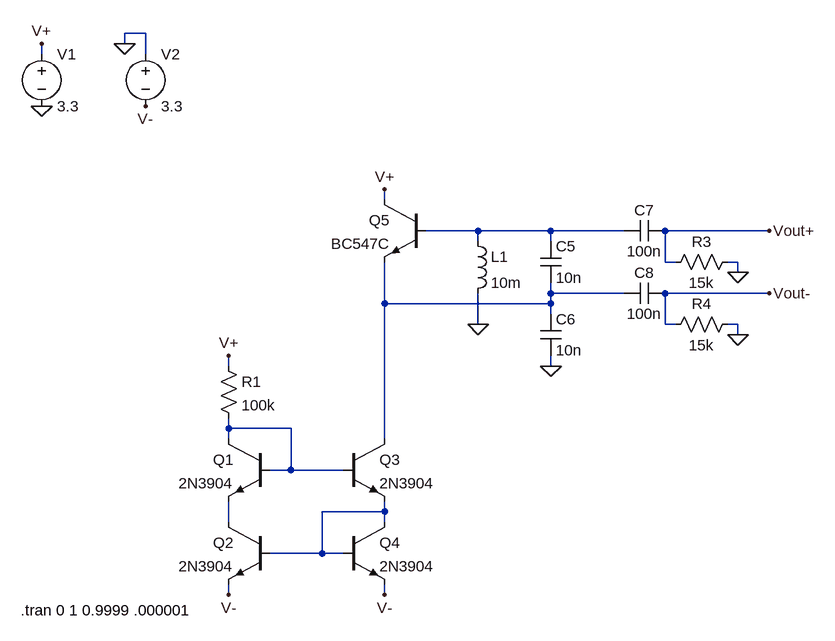
[diagram p0: schematic 06A-20.asc]
06A-20.asc, the LTspice schematic file:
Version 4.1
SHEET 1 1064 776
WIRE 16 -160 -16 -160
WIRE -16 -144 -16 -160
WIRE -144 -128 -144 -144
WIRE 16 -128 16 -160
WIRE 384 96 384 80
WIRE 528 144 448 144
WIRE 640 144 528 144
WIRE 752 144 640 144
WIRE 976 144 816 144
WIRE 528 160 528 144
WIRE 640 160 640 144
WIRE 816 192 816 144
WIRE 832 192 816 192
WIRE 928 192 912 192
WIRE 928 208 928 192
WIRE 640 240 640 224
WIRE 752 240 640 240
WIRE 976 240 816 240
WIRE 384 256 384 192
WIRE 640 256 640 240
WIRE 640 256 384 256
WIRE 640 272 640 256
WIRE 528 288 528 240
WIRE 816 288 816 240
WIRE 832 288 816 288
WIRE 928 288 912 288
WIRE 928 304 928 288
WIRE 144 352 144 336
WIRE 640 352 640 336
WIRE 144 448 144 432
WIRE 240 448 144 448
WIRE 144 464 144 448
WIRE 384 464 384 256
WIRE 240 512 240 448
WIRE 240 512 208 512
WIRE 320 512 240 512
WIRE 384 576 384 560
WIRE 384 576 288 576
WIRE 144 592 144 560
WIRE 384 592 384 576
WIRE 288 640 288 576
WIRE 288 640 208 640
WIRE 320 640 288 640
WIRE 144 704 144 688
WIRE 384 704 384 688
FLAG -144 -48 0
FLAG -144 -144 V+
FLAG 640 352 0
FLAG 144 336 V+
FLAG 384 80 V+
FLAG 976 144 Vout+
FLAG 976 240 Vout-
FLAG 928 208 0
FLAG 928 304 0
FLAG -16 -144 0
FLAG 16 -48 V-
FLAG 144 704 V-
FLAG 384 704 V-
FLAG 528 288 0
SYMBOL voltage -144 -144 R0
WINDOW 123 0 0 Left 0
WINDOW 39 0 0 Left 0
SYMATTR InstName V1
SYMATTR Value 3.3
SYMBOL ind 512 144 R0
SYMATTR InstName L1
SYMATTR Value 10m
SYMBOL cap 624 160 R0
SYMATTR InstName C5
SYMATTR Value 10n
SYMBOL cap 624 272 R0
SYMATTR InstName C6
SYMATTR Value 10n
SYMBOL npn 448 96 M0
SYMATTR InstName Q5
SYMATTR Value BC547C
SYMBOL npn 320 464 R0
SYMATTR InstName Q3
SYMATTR Value 2N3904
SYMBOL npn 208 464 M0
SYMATTR InstName Q1
SYMATTR Value 2N3904
SYMBOL npn 320 592 R0
SYMATTR InstName Q4
SYMATTR Value 2N3904
SYMBOL npn 208 592 M0
SYMATTR InstName Q2
SYMATTR Value 2N3904
SYMBOL res 128 336 R0
SYMATTR InstName R1
SYMATTR Value 100k
SYMBOL cap 816 224 R90
WINDOW 0 0 32 VBottom 2
WINDOW 3 32 32 VTop 2
SYMATTR InstName C8
SYMATTR Value 100n
SYMBOL cap 816 128 R90
WINDOW 0 0 32 VBottom 2
WINDOW 3 32 32 VTop 2
SYMATTR InstName C7
SYMATTR Value 100n
SYMBOL res 816 208 R270
WINDOW 0 32 56 VTop 2
WINDOW 3 0 56 VBottom 2
SYMATTR InstName R3
SYMATTR Value 15k
SYMBOL res 816 304 R270
WINDOW 0 32 56 VTop 2
WINDOW 3 0 56 VBottom 2
SYMATTR InstName R4
SYMATTR Value 15k
SYMBOL voltage 16 -144 R0
WINDOW 123 0 0 Left 0
WINDOW 39 0 0 Left 0
SYMATTR InstName V2
SYMATTR Value 3.3
TEXT -176 728 Left 2 !.tran 0 1 0.9999 .000001

The netlist it stands for:
* 06A-20.asc
V1 V+ 0 3.3
L1 N001 0 10m
C5 N001 N002 10n
C6 N002 0 10n
Q5 V+ N001 N002 0 BC547C
Q3 N002 N003 N004 0 2N3904
Q1 N003 N003 N005 0 2N3904
Q4 N004 N004 V- 0 2N3904
Q2 N005 N004 V- 0 2N3904
R1 V+ N003 100k
C8 Vout- N002 100n
C7 Vout+ N001 100n
R3 Vout+ 0 15k
R4 Vout- 0 15k
V2 0 V- 3.3
.model NPN NPN
.model PNP PNP
.lib standard.bjt
.tran 0 1 0.9999 .000001
.backanno
.end